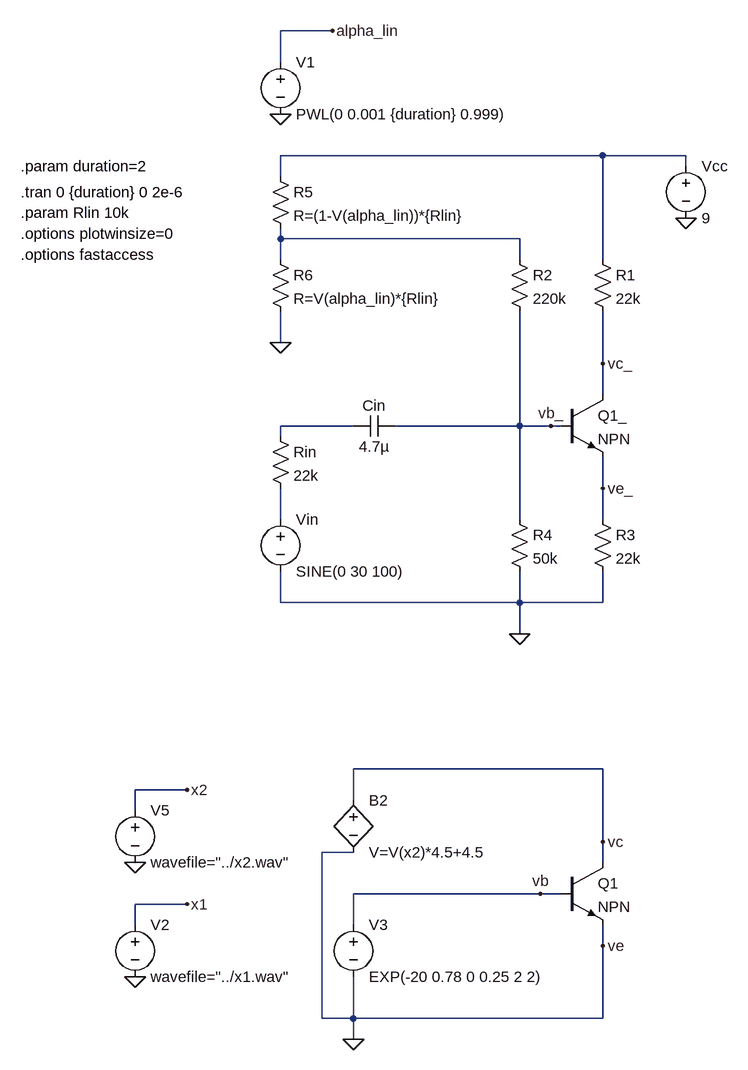
[diagram p0: schematic fuzz_dc.asc]
fuzz_dc.asc, the LTspice schematic file:
Version 4
SHEET 1 880 1124
WIRE -160 -464 -240 -464
WIRE -240 -416 -240 -464
WIRE 256 -272 -240 -272
WIRE 384 -272 256 -272
WIRE 384 -256 384 -272
WIRE -240 -240 -240 -272
WIRE -240 -144 -240 -160
WIRE 128 -144 -240 -144
WIRE -240 -112 -240 -144
WIRE 128 -112 128 -144
WIRE 256 -112 256 -272
WIRE -240 16 -240 -32
WIRE 256 48 256 -32
WIRE 256 96 256 48
WIRE -128 144 -240 144
WIRE 128 144 128 -32
WIRE 128 144 -64 144
WIRE 176 144 128 144
WIRE 192 144 176 144
WIRE -240 160 -240 144
WIRE 256 240 256 192
WIRE -240 288 -240 240
WIRE 128 288 128 144
WIRE 256 288 256 240
WIRE -240 416 -240 368
WIRE 128 416 128 368
WIRE 128 416 -240 416
WIRE 256 416 256 368
WIRE 256 416 128 416
WIRE 128 464 128 416
WIRE 256 672 -128 672
WIRE -384 704 -464 704
WIRE -128 720 -128 672
WIRE -464 736 -464 704
WIRE 256 784 256 672
WIRE -128 800 -176 800
WIRE 256 816 256 784
WIRE 160 864 -128 864
WIRE 192 864 160 864
WIRE -384 880 -464 880
WIRE -464 912 -464 880
WIRE -128 912 -128 864
WIRE 256 944 256 912
WIRE -176 1056 -176 800
WIRE -128 1056 -128 992
WIRE -128 1056 -176 1056
WIRE 256 1056 256 944
WIRE 256 1056 -128 1056
WIRE -128 1088 -128 1056
FLAG 384 -176 0
FLAG 128 464 0
FLAG 176 144 vb_
FLAG 256 48 vc_
FLAG 256 240 ve_
FLAG -240 -336 0
FLAG -160 -464 alpha_lin
FLAG -240 16 0
FLAG -464 992 0
FLAG -384 880 x1
FLAG -464 816 0
FLAG -384 704 x2
FLAG 160 864 vb
FLAG 256 784 vc
FLAG 256 944 ve
FLAG -128 1088 0
SYMBOL res 240 -128 R0
SYMATTR InstName R1
SYMATTR Value 22k
SYMBOL res 112 -128 R0
SYMATTR InstName R2
SYMATTR Value 220k
SYMBOL voltage 384 -272 R0
WINDOW 123 0 0 Left 0
WINDOW 39 0 0 Left 0
SYMATTR InstName Vcc
SYMATTR Value 9
SYMBOL res 240 272 R0
SYMATTR InstName R3
SYMATTR Value 22k
SYMBOL res 112 272 R0
SYMATTR InstName R4
SYMATTR Value 50k
SYMBOL res -256 -256 R0
SYMATTR InstName R5
SYMATTR Value R=(1-V(alpha_lin))*{Rlin}
SYMBOL res -256 -128 R0
SYMATTR InstName R6
SYMATTR Value R=V(alpha_lin)*{Rlin}
SYMBOL npn 192 96 R0
SYMATTR InstName Q1_
SYMBOL voltage -240 -432 R0
WINDOW 123 0 0 Left 0
WINDOW 39 0 0 Left 0
SYMATTR InstName V1
SYMATTR Value PWL(0 0.001 {duration} 0.999)
SYMBOL cap -64 128 R90
WINDOW 0 0 32 VBottom 2
WINDOW 3 32 32 VTop 2
SYMATTR InstName Cin
SYMATTR Value 4.7µ
SYMBOL voltage -240 272 R0
WINDOW 123 0 0 Left 0
WINDOW 39 0 0 Left 0
SYMATTR InstName Vin
SYMATTR Value SINE(0 30 100)
SYMBOL res -256 144 R0
SYMATTR InstName Rin
SYMATTR Value 22k
SYMBOL npn 192 816 R0
SYMATTR InstName Q1
SYMBOL voltage -464 896 R0
SYMATTR InstName V2
SYMATTR Value wavefile="../x1.wav"
SYMBOL voltage -464 720 R0
SYMATTR InstName V5
SYMATTR Value wavefile="../x2.wav"
SYMBOL bv -128 704 R0
SYMATTR InstName B2
SYMATTR Value V=V(x2)*4.5+4.5
SYMBOL voltage -128 896 R0
WINDOW 123 0 0 Left 0
WINDOW 39 0 0 Left 0
SYMATTR InstName V3
SYMATTR Value EXP(-20 0.78 0 0.25 2 2)
TEXT -640 -184 Left 2 !.param Rlin 10k
TEXT -640 -256 Left 2 !.param duration=2
TEXT -640 -216 Left 2 !.tran 0 {duration} 0 2e-6
TEXT -640 -152 Left 2 !.options plotwinsize=0
TEXT -640 -120 Left 2 !.options fastaccess

The netlist it stands for:
* fuzz_dc.asc
R1 N001 vc_ 22k
R2 N002 vb_ 220k
Vcc N001 0 9
R3 ve_ 0 22k
R4 vb_ 0 50k
R5 N001 N002 R=(1-V(alpha_lin))*{Rlin}
R6 N002 0 R=V(alpha_lin)*{Rlin}
Q1_ vc_ vb_ ve_ 0 NPN
V1 alpha_lin 0 PWL(0 0.001 {duration} 0.999)
Cin vb_ N003 4.7µ
Vin N004 0 SINE(0 30 100)
Rin N003 N004 22k
Q1 vc vb 0 0 NPN
V2 x1 0 wavefile="../x1.wav"
V5 x2 0 wavefile="../x2.wav"
B2 vc 0 V=V(x2)*4.5+4.5
V3 vb 0 EXP(-20 0.78 0 0.25 2 2)
.model NPN NPN
.model PNP PNP
.lib standard.bjt
.param Rlin 10k
.param duration=2
.tran 0 {duration} 0 2e-6
.options plotwinsize=0
.options fastaccess
.backanno
.end